# Altium schematic sheet zasilanie.SchDoc
size A4
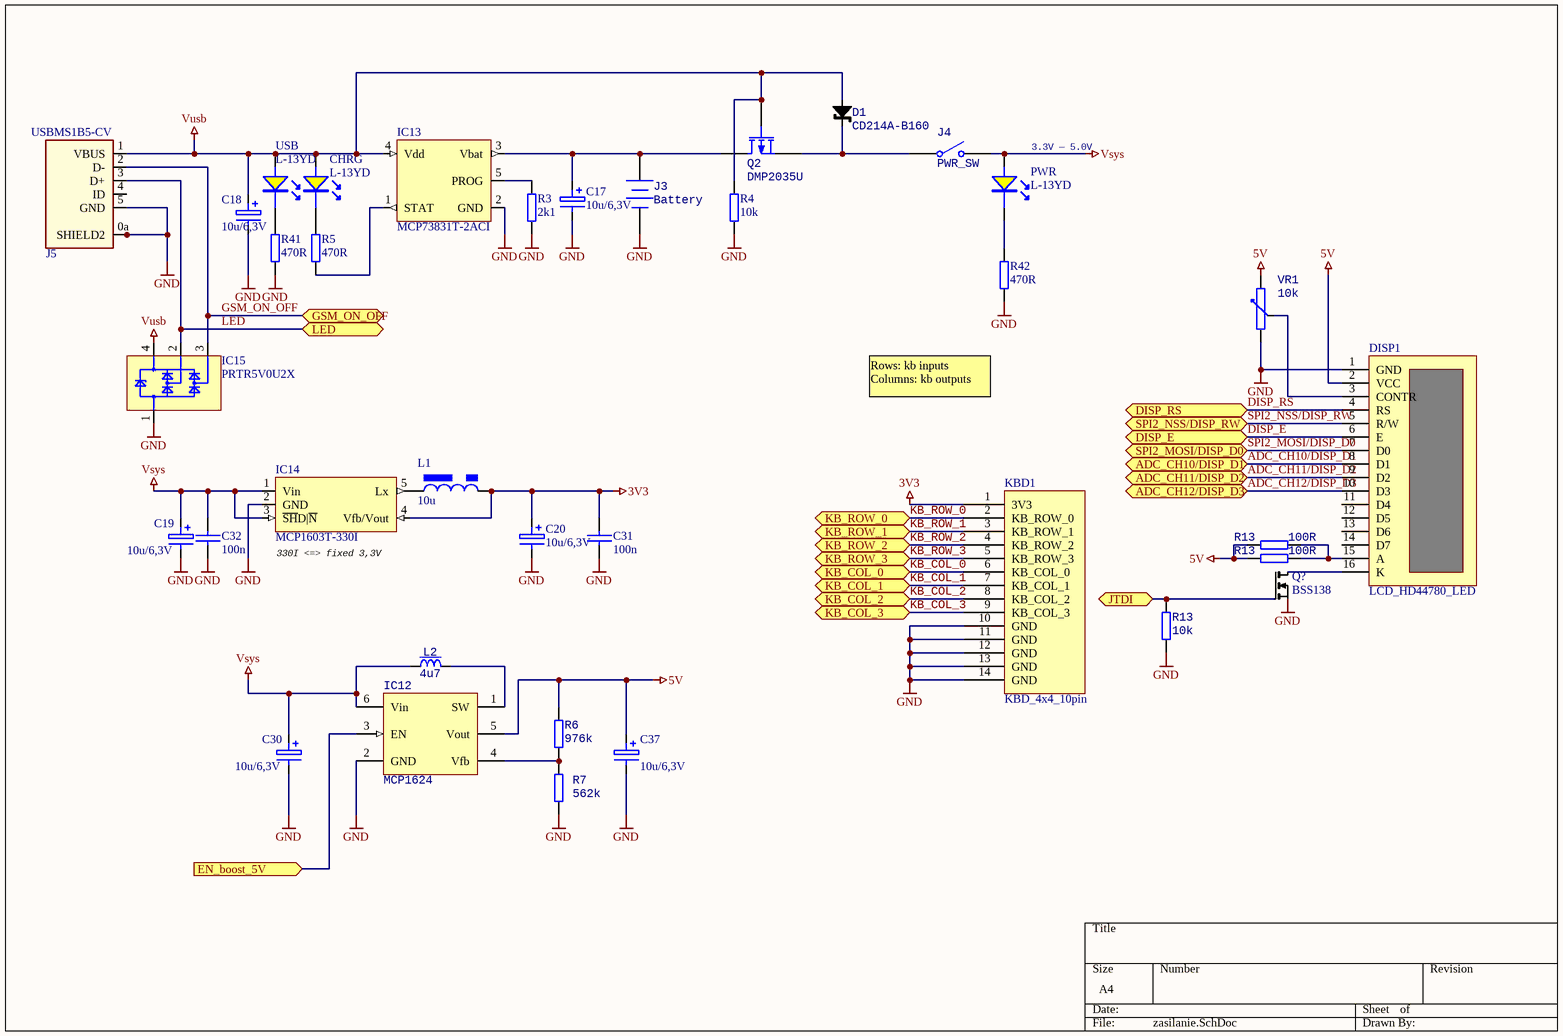
[diagram p0: zasilanie.SchDoc]

## Parts
(Parts that share a designator on the sheet are numbered #1, #2 ... from top to bottom, then left to right.)
C17  10u/6,3V  [1411_SMDB]
C18  10u/6,3V  [1411_SMDB]
C19  10u/6,3V  [1411_SMDB]
C20  10u/6,3V  [1411_SMDB]
C30  10u/6,3V  [1411_SMDB]
C31  100n  [0603C]
C32  100n  [0603C]
C37  10u/6,3V  [1411_SMDB]
CHRG  L-13YD  [LED_L-13YD]
D1  CD214A-B160  [DO-214AC/SMA]
DISP1  LCD_HD44780_LED  [IDC16]
IC12  MCP1624  [SOT23-6]
IC13  MCP73831T-2ACI  [SOT23-5]
IC14  MCP1603T-330I  [SOT23-5]
IC15  PRTR5V0U2X  [sot143b]
J3  Battery  [CON_WF02S-LF]
J4  PWR_SW  [HDR1X2]
J5  USBMS1B5-CV  [USBMS1B5-CV]
KBD1  KBD_4x4_10pin  [KBD]
L1  10u  [1411_SMDB]
L2  4u7  [IND_BOURNS_PM43]
PWR  L-13YD  [LED_L-13YD]
Q2  DMP2035U  [sot-23]
Q?  BSS138  [SOT-23]
R3  2k1  [0603R]
R4  10k  [0603R]
R5  470R  [0603R]
R6  976k  [0603R]
R7  562k  [0603R]
R13#1  100R  [0603R]
R13#2  100R  [0603R]
R13#3  10k  [0603R]
R41  470R  [0603R]
R42  470R  [0603R]
USB  L-13YD  [LED_L-13YD]
VR1  10k  [POT_RM6v]

## Ports
ADC_CH10/DISP_D1, ADC_CH11/DISP_D2, ADC_CH12/DISP_D3, DISP_E, DISP_RS, EN_boost_5V (in), GSM_ON_OFF, JTDI, KB_COL_0, KB_COL_1, KB_COL_2, KB_COL_3, KB_ROW_0, KB_ROW_1, KB_ROW_2, KB_ROW_3, LED, SPI2_MOSI/DISP_D0, SPI2_NSS/DISP_RW

## Nets
3V3: C20.1 C31.1 IC14.4(Vfb/Vout) KBD1.1(3V3) L1.2
5V: C37.1 DISP1.2(VCC) IC12.5(Vout) R6.2 R13#1.2 R13#2.2 VR1.3(U)
GND: C17.2 C18.2 C19.2 C20.2 C30.2 C31.2 C32.2 C37.2 DISP1.1(GND) IC12.2(GND) IC13.2(GND) IC14.2(GND) IC15.1 J3.2(-) J5.0a(SHIELD2) J5.0b(SHIELD2) J5.0c(SHIELD2) J5.0d(SHIELD2) J5.5(GND) KBD1.10(GND) KBD1.11(GND) KBD1.12(GND) KBD1.13(GND) KBD1.14(GND) Q?.2(S) R3.1 R4.1 R7.1 R13#3.1 R41.2 R42.2 VR1.1(D)
Vsys: C19.1 C30.1 C32.1 IC12.6(Vin) IC14.1(Vin) IC14.3(~{SH}D|~{N}) J4.2(NO) L2.1 PWR.A
Vusb: C18.1 CHRG.A D1.A IC13.4(Vdd) IC15.4 J5.1(VBUS) Q2.2(G) R4.2 USB.A
ADC_CH10/DISP_D1: DISP1.8(D1) ; port ADC_CH10/DISP_D1
ADC_CH11/DISP_D2: DISP1.9(D2) ; port ADC_CH11/DISP_D2
ADC_CH12/DISP_D3: DISP1.10(D3) ; port ADC_CH12/DISP_D3
DISP_E: DISP1.6(E) ; port DISP_E
DISP_RS: DISP1.4(RS) ; port DISP_RS
EN_boost_5V: IC12.3(EN) ; port EN_boost_5V
GSM_ON_OFF: IC15.3 J5.2(D-) ; port GSM_ON_OFF
JTDI: Q?.1(G) R13#3.2 ; port JTDI
KB_COL_0: KBD1.6(KB_COL_0) ; port KB_COL_0
KB_COL_1: KBD1.7(KB_COL_1) ; port KB_COL_1
KB_COL_2: KBD1.8(KB_COL_2) ; port KB_COL_2
KB_COL_3: KBD1.9(KB_COL_3) ; port KB_COL_3
KB_ROW_0: KBD1.2(KB_ROW_0) ; port KB_ROW_0
KB_ROW_1: KBD1.3(KB_ROW_1) ; port KB_ROW_1
KB_ROW_2: KBD1.4(KB_ROW_2) ; port KB_ROW_2
KB_ROW_3: KBD1.5(KB_ROW_3) ; port KB_ROW_3
LED: IC15.2 J5.3(D+) ; port LED
SPI2_MOSI/DISP_D0: DISP1.7(D0) ; port SPI2_MOSI/DISP_D0
SPI2_NSS/DISP_RW: DISP1.5(R/W) ; port SPI2_NSS/DISP_RW
NetC17_1: C17.1 IC13.3(Vbat) J3.1(+) Q2.1(D)
NetCHRG_K: CHRG.K R5.1
NetD1_K: D1.K J4.1(COMMON) Q2.3(S)
NetDISP1_3: DISP1.3(CONTR) VR1.2(W)
NetDISP1_15: DISP1.15(A) R13#1.1 R13#2.1
NetDISP1_16: DISP1.16(K) Q?.3(D)
NetIC12_1: IC12.1(SW) L2.2
NetIC12_4: IC12.4(Vfb) R6.1 R7.2
NetIC13_1: IC13.1(STAT) R5.2
NetIC13_5: IC13.5(PROG) R3.2
NetIC14_5: IC14.5(Lx) L1.1
NetPWR_K: PWR.K R42.1
NetR41_1: R41.1 USB.K

Not connected (* = marked no-connect by the designer): DISP1 11(D4) 12(D5) 13(D6) 14(D7); J5 4(ID)

## Notes on the sheet
- (near PWR) 3.3V — 5.0V
- Rows: kb inputs
  Columns: kb outputs
- (near IC14) 330I <=> fixed 3,3V

## Library data of the parts
C17-C20 C30 C37 = CAP_TANTALIUM: Tantalium Capacitor
C31 C32 = CAP_general: Capacitor
CHRG PWR USB = LED_THT_2mm_Y: LED (TME)
D1 = D_LS101A: Schottky, 60V, 1A; Farnell: 1456528
DISP1 = LCD_HD44780_LED: LCD character display socket with backlight
IC12 = DC/DC_MCP1640: Adjustable 5V/350mA Step-up DC/DC converter (TME)
IC13 = REG_MCP73831: Single-Cell, Fully Integrated Li-Ion charger
IC14 = PWM_MCP1603T: 3.3V. 500mA buck regulator
IC15 = D_TVS_PRTR5V0U2X: dual 5.5 ESD transient voltage suppressor
J3 = Battery: Multicell Battery; Published: 24-Mar-1999; LatestRevisionDate: 17-Jul-2002; LatestRevisionNote: Re-released for DXP Platform.; PackageReference: BAT-2; Publisher: Altium Limited; PackageDescription: Battery; 2 Leads
J4 = SW-SPST: Single-Pole, Single-Throw Switch; Published: 24-Mar-1999; LatestRevisionDate: 17-Jul-2002; LatestRevisionNote: Re-released for DXP Platform.; PackageReference: SPST-2; Publisher: Altium Limited; PackageDescription: Switch; 2 Leads
J5 = CON_USB_B_MINI: USB mini B connector (Maritex); Part Number: 10133; Device: USB_Mini_AB
KBD1 = KBD_4x4_10pin: pin to pad: 11>10a 12>10b 13>10c 14>10d
L1 = L_POWER: inductor
L2 = IND_10UH_20%_BOURNS_PM43: Inductor With Magnetic core; Part Description: SMD Power Inductors; Manufacturer: BOURNS; Manufacturer Part Number: PM43-100M-RC; Value: 10uH; Power: 1.15A; Resistance: 0.18R; Tolerance: ±20%; Table: Inductors SMD; Part Number: IND_10UH_20%_BOURNS_PM43; Component Kind: Standard; Component Type: Standard; Pin Count: 2; Status: None; Mounted: Yes; Socket: No; SMD: Yes; ComponentHeight: 3.5mm; HelpURL: \\cern.ch\dfs\Applications\Altium\Datasheets\IND_BOURNS_PM43.pdf; Author: CERN DEM JLC; CreateDate: 2011-05-17; LatestRevisionDate: 2011-05-17
Q2 = MOSFET-P: P-Channel MOSFET; Published: 8-Jun-2000; LatestRevisionDate: 17-Jul-2002; LatestRevisionNote: Re-released for DXP Platform.; PackageVersion: 1995/1996; PackageReference: E3; Publisher: Altium Limited; PackageDescription: TO, Flat Index; 3 In-Line, Axial Leads; Body Dia. 4.6mm; Lead Dia. 0.5 mm (max); farnell: 2061419
Q? = Q_BSS138
R3-R7 R13#1-R13#3 R41 R42 = RES_0603: SMD Resistor
VR1 = TRIMPOT_RM6_HOR: Carbon trimpot, 0.1W, +/- 30%; Farnell: 1227558